# Altium project PTW_SENS_V1.PrjPcb
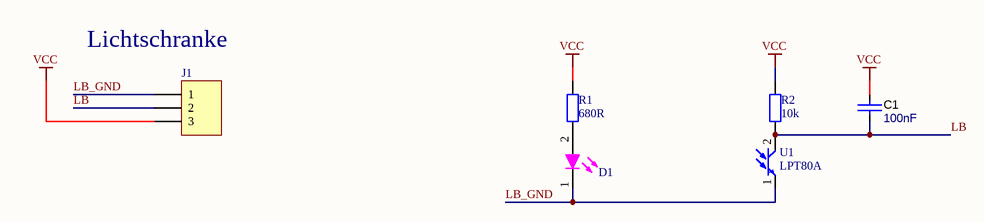
[diagram p0: PTW_SENS.SchDoc]
1 sheet, 6 parts. Net scope: global (net labels, ports and power ports of the same name join across sheets).
Board file: PTW_SENS_V1.PcbDoc

## Sheet PTW_SENS.SchDoc
size A4

### Parts
C1  100nF  [CAPC0402(1005)60_N]
D1  IRL80A  [IRL80A]  (value not drawn)
J1  Pin1x3  [HDR1X3]  (value not drawn)
R1  value 680R  [RESC0402(1005)_N]  (hidden comment: RES_0402)
R2  value 10k  [RESC0402(1005)_N]  (hidden comment: RES_0402)
U1  LPT80A  [LPT80A]

### Nets
VCC: C1.1 J1.3 R1.1 R2.1
LB: C1.2 J1.2 R2.2 U1.2(C)
LB_GND: D1.1(K) J1.1 U1.1(E)
NetD1_2: D1.2(A) R1.2

### Notes on the sheet
- (near J1) Lichtschranke

### Library data of the parts
C1 = CAPC_25V_X5R_0.47µF_0402: Capacitor SMD Cer 0.47µF 10% 25V X5R 0402; Manufacturer: TDK; Manufacturer Part Number: C1005X5R1E105K050BC; Betriebstemperatur: -55°C bis 85°C; Dicke: 0.55mm; Tolerance: 10%; Package / Case: 0402 (1005 metric); Spannung - Nenn: 25V; Temperaturwirkungsgrad: X5R; Value: 100nF
D1 = IRL80A: GaAs Infrared Emitter; Color: blue; Dicke: 0.35mm; Abstrahlwinkel: 180°; Spannung - Nenn: ?; Current: ?; Brightness: ?; Package / Case: 0402 (1005 metric); Manufacturer: *; Manufacturer Part Number: *; Supplier 1: Mouser; Supplier 2: Digi-Key; Supplier Part Number 1: 720-IRL80A; Supplier Part Number 2: 475-1364-ND
J1 = Pin1x3: Pinheader 1 Row 3Pins
R1 R2 = RES_0402: R_0402; Tolerance: ±?%; Ratings: 1/10W; Package / Case: 0402 (1005 metric); Manufacturer: ?; Manufacturer Part Number: ?
U1 = LPT80A: Silicon NPN Phototransistor; Supplier 1: Mouser; Supplier 2: Digi-Key; Supplier Part Number 1: 720-LPT80A; Supplier Part Number 2: 475-1419-ND